# EAGLE design PIC Schematic (EAGLE 9.6.2)
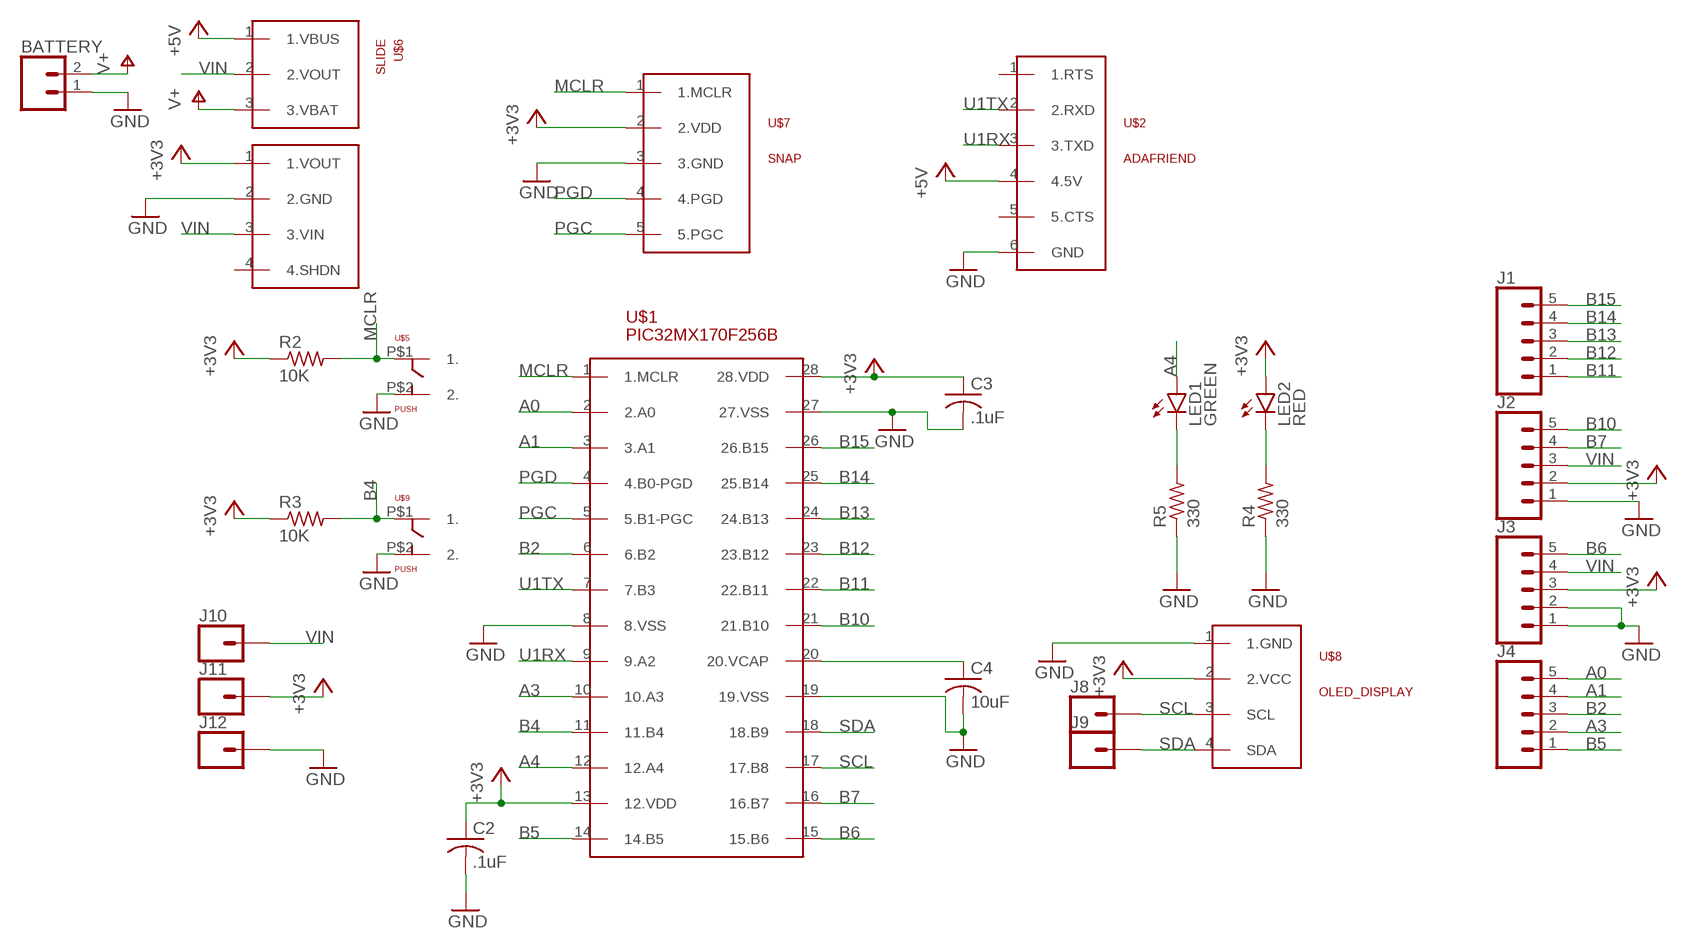
[diagram p0: schematic, sheet 1]

## Parts
BATTERY  CONN_02  [1X02]
C2  .1uF  C-US025-030X050  [C025-030X050]
C3  .1uF  C-US025-030X050  [C025-030X050]
C4  10uF  C-US025-030X050  [C025-030X050]
J1  CONN_05  [1X05]
J2  CONN_05  [1X05]
J3  CONN_05  [1X05]
J4  CONN_05  [1X05]
J8  CONN_01  [1X01]
J9  CONN_01  [1X01]
J10  CONN_01  [1X01]
J11  CONN_01  [1X01]
J12  CONN_01  [1X01]
LED1  GREEN  LED3MM  [LED3MM]
LED2  RED  LED3MM  [LED3MM]
R2  10K  R-US_0207/10  [0207/10]
R3  10K  R-US_0207/10  [0207/10]
R4  330  R-US_0207/10  [0207/10]
R5  330  R-US_0207/10  [0207/10]
U$1  PIC32MX170F256B  [DIL28-3]
U$2  ADAFRIEND  [ADAFRIEND]
U$3  POLOLU_3V3  [POLOLU_3V3]
U$5  PUSH  [PUSH]
U$6  SLIDE  [SLIDE]
U$7  SNAP  [SNAP]
U$8  OLED_DISPLAY  [OLED_DISPLAY]
U$9  PUSH  [PUSH]

## Nets
+3V3: C2.1 C3.1 J2.2 J3.3 J11.1 LED2.A R2.1 R3.1 U$1.13(12.VDD) U$1.28(28.VDD) U$3.1(1.VOUT) U$7.2(2.VDD) U$8.2(2.VCC)
+5V: U$2.4(4.5V) U$6.1(1.VBUS)
A0: J4.5 U$1.2(2.A0)
A1: J4.4 U$1.3(3.A1)
A3: J4.2 U$1.10(10.A3)
A4: LED1.A U$1.12(12.A4)
B2: J4.3 U$1.6(6.B2)
B4: R3.2 U$1.11(11.B4) U$9.P$1(1.)
B5: J4.1 U$1.14(14.B5)
B6: J3.5 U$1.15(15.B6)
B7: J2.4 U$1.16(16.B7)
B10: J2.5 U$1.21(21.B10)
B11: J1.1 U$1.22(22.B11)
B12: J1.2 U$1.23(23.B12)
B13: J1.3 U$1.24(24.B13)
B14: J1.4 U$1.25(25.B14)
B15: J1.5 U$1.26(26.B15)
GND: BATTERY.1 C2.2 C3.2 C4.2 J2.1 J3.1 J3.2 J12.1 R4.1 R5.1 U$1.8(8.VSS) U$1.19(19.VSS) U$1.27(27.VSS) U$2.6(GND) U$3.2(2.GND) U$5.P$2(2.) U$7.3(3.GND) U$8.1(1.GND) U$9.P$2(2.)
MCLR: R2.2 U$1.1(1.MCLR) U$5.P$1(1.) U$7.1(1.MCLR)
N$1: C4.1 U$1.20(20.VCAP)
N$2: LED1.K(C) R5.2
N$3: LED2.K(C) R4.2
PGC: U$1.5(5.B1-PGC) U$7.5(5.PGC)
PGD: U$1.4(4.B0-PGD) U$7.4(4.PGD)
SCL: J8.1 U$1.17(17.B8) U$8.3(SCL)
SDA: J9.1 U$1.18(18.B9) U$8.4(SDA)
U1RX: U$1.9(9.A2) U$2.3(3.TXD)
U1TX: U$1.7(7.B3) U$2.2(2.RXD)
V+: BATTERY.2 U$6.3(3.VBAT)
VIN: J2.3 J3.4 J10.1 U$3.3(3.VIN) U$6.2(2.VOUT)
Unconnected: U$2.1(1.RTS) U$2.5(5.CTS) U$3.4(4.SHDN)

## Library data of the parts
BATTERY = pic-library:CONN_02: Multi connection point. Often used as Generic Header-pin footprint for 0.1 inch spaced/style header connections On any of the 0.1 inch spaced packages, you can populate with these: Break Away Headers - Straight <https://www.sparkfun.com/products/116> (PRT-00116) Break Away Male Headers - Right Angle <https://www.sparkfun.com/products/553> (PRT-00553) Female Headers <https://www.sparkfun.com/products/115> (PRT-00115) Break Away Headers - Machine Pin <https://www.sparkfun.com/products/117> (PRT-00117) Break Away Female Headers - Swiss Machine Pin <https://www.sparkfun.com/products/743> (PRT-00743) For SCREWTERMINALS and SPRING TERMINALS visit here: Screw Terimnals on SparkFun.com <https://www.sparkfun.com/search/results?term=Screw+Terminals> (5mm/3.5mm/2.54mm spacing) This device is also useful as a general connection point to wire up your design to another part of your project. Our various solder wires solder well into these plated through hole pads. Hook-Up Wire - Assortment (Stranded, 22 AWG) <https://www.sparkfun.com/products/11375> (PRT-11375) Hook-Up Wire - Assortment (Solid Core, 22 AWG) <https://www.sparkfun.com/products/11367> (PRT-11367) View the entire wire category on our website here <https://www.sparkfun.com/categories/141> Special notes: Molex polarized connector foot print use with: PRT-08233 with associated crimp pins and housings. 2.54_SCREWTERM for use with PRT-10571. 3.5mm Screw Terminal footprints for PRT-08084 5mm Screw Terminal footprints for use with PRT-08432
C2-C4 = pic-library:C-US: CAPACITOR, American symbol; SPICEPREFIX: C
J1-J4 = pic-library:CONN_05: Multi connection point. Often used as Generic Header-pin footprint for 0.1 inch spaced/style header connections On any of the 0.1 inch spaced packages, you can populate with these: Break Away Headers - Straight <https://www.sparkfun.com/products/116> (PRT-00116) Break Away Male Headers - Right Angle <https://www.sparkfun.com/products/553> (PRT-00553) Female Headers <https://www.sparkfun.com/products/115> (PRT-00115) Break Away Headers - Machine Pin <https://www.sparkfun.com/products/117> (PRT-00117) Break Away Female Headers - Swiss Machine Pin <https://www.sparkfun.com/products/743> (PRT-00743) For SCREWTERMINALS and SPRING TERMINALS visit here: Screw Terimnals on SparkFun.com <https://www.sparkfun.com/search/results?term=Screw+Terminals> (5mm/3.5mm/2.54mm spacing) This device is also useful as a general connection point to wire up your design to another part of your project. Our various solder wires solder well into these plated through hole pads. Hook-Up Wire - Assortment (Stranded, 22 AWG) <https://www.sparkfun.com/products/11375> (PRT-11375) Hook-Up Wire - Assortment (Solid Core, 22 AWG) <https://www.sparkfun.com/products/11367> (PRT-11367) View the entire wire category on our website here <https://www.sparkfun.com/categories/141> Special notes: Molex polarized connector foot print use with SKU : PRT-08231 with associated crimp pins and housings. 1MM SMD Version SKU: PRT-10208
J8-J12 = pic-library:CONN_01: Single connection point. Often used as Generic Header-pin footprint for 0.1 inch spaced/style header connections On any of the 0.1 inch spaced packages, you can populate with these: Break Away Headers - Straight <https://www.sparkfun.com/products/116> (PRT-00116) Break Away Male Headers - Right Angle <https://www.sparkfun.com/products/553> (PRT-00553) Female Headers <https://www.sparkfun.com/products/115> (PRT-00115) Break Away Headers - Machine Pin <https://www.sparkfun.com/products/117> (PRT-00117) Break Away Female Headers - Swiss Machine Pin <https://www.sparkfun.com/products/743> (PRT-00743) This device is also useful as a general connection point to wire up your design to another part of your project. Our various solder wires solder well into these plated through hole pads. Hook-Up Wire - Assortment (Stranded, 22 AWG) <https://www.sparkfun.com/products/11375> (PRT-11375) Hook-Up Wire - Assortment (Solid Core, 22 AWG) <https://www.sparkfun.com/products/11367> (PRT-11367) View the entire wire category on our website here <https://www.sparkfun.com/categories/141> Special notes: SMTSO-256-ET is a "flush mount" nut for a 4-40 screw. We mostly use this on specialty testbeds; it is a nice way to connect hardware to your PCB at an adjustable hieght. Also note, the SNAP packages are for using a snappable style connector. We sell a baggie of snaps and they are also used on two LilyPad designs: Snap Assortment - 30 pack (male and female) <https://www.sparkfun.com/products/11347> (DEV-11347) LilyPad Arduino SimpleSnap <https://www.sparkfun.com/products/10941> (DEV-10941) LilyPad SimpleSnap Protoboard <https://www.sparkfun.com/products/10940> (DEV-10940)
LED1 LED2 = pic-library:LED: LED OSRAM: - CHIPLED LG R971, LG N971, LY N971, LG Q971, LY Q971, LO R971, LY R971 LH N974, LH R974 LS Q976, LO Q976, LY Q976 LO Q996 - Hyper CHIPLED LW Q18S LB Q993, LB Q99A, LB R99A - SideLED LS A670, LO A670, LY A670, LG A670, LP A670 LB A673, LV A673, LT A673, LW A673 LH A674 LY A675 LS A676, LA A676, LO A676, LY A676, LW A676 LS A679, LY A679, LG A679 - Hyper Micro SIDELED® LS Y876, LA Y876, LO Y876, LY Y876 LT Y87S - SmartLED LW L88C, LW L88S LB L89C, LB L89S, LG L890 LS L89K, LO L89K, LY L89K LS L896, LA L896, LO L896, LY L896 - TOPLED LS T670, LO T670, LY T670, LG T670, LP T670 LSG T670, LSP T670, LSY T670, LOP T670, LYG T670 LG T671, LOG T671, LSG T671 LB T673, LV T673, LT T673, LW T673 LH T674 LS T676, LA T676, LO T676, LY T676, LB T676, LH T676, LSB T676, LW T676 LB T67C, LV T67C, LT T67C, LS T67K, LO T67K, LY T67K, LW E67C LS E67B, LA E67B, LO E67B, LY E67B, LB E67C, LV E67C, LT E67C LW T67C LS T679, LY T679, LG T679 LS T770, LO T770, LY T770, LG T770, LP T770 LB T773, LV T773, LT T773, LW T773 LH T774 LS E675, LA E675, LY E675, LS T675 LS T776, LA T776, LO T776, LY T776, LB T776 LHGB T686 LT T68C, LB T68C - Hyper Mini TOPLED® LB M676 - Mini TOPLED Santana® LG M470 LS M47K, LO M47K, LY M47K Source: http://www.osram.convergy.de LUXEON: - LUMILED® LXK2-PW12-R00, LXK2-PW12-S00, LXK2-PW14-U00, LXK2-PW14-V00 LXK2-PM12-R00, LXK2-PM12-S00, LXK2-PM14-U00 LXK2-PE12-Q00, LXK2-PE12-R00, LXK2-PE12-S00, LXK2-PE14-T00, LXK2-PE14-U00 LXK2-PB12-K00, LXK2-PB12-L00, LXK2-PB12-M00, LXK2-PB14-N00, LXK2-PB14-P00, LXK2-PB14-Q00 LXK2-PR12-L00, LXK2-PR12-M00, LXK2-PR14-Q00, LXK2-PR14-R00 LXK2-PD12-Q00, LXK2-PD12-R00, LXK2-PD12-S00 LXK2-PH12-R00, LXK2-PH12-S00 LXK2-PL12-P00, LXK2-PL12-Q00, LXK2-PL12-R00 Source: www.luxeon.com KINGBRIGHT: KA-3528ASYC Source: www.kingbright.com
R2-R5 = pic-library:R-US_: RESISTOR, American symbol; SPICEPREFIX: R
U$1 = pic-library:PIC32MX170F256B
U$2 = pic-library:ADAFRIEND
U$3 = pic-library:POLOLU_3V3
U$5 U$9 = pic-library:PUSH
U$6 = pic-library:SLIDE
U$7 = pic-library:SNAP
U$8 = pic-library:OLED_DISPLAY

## Board
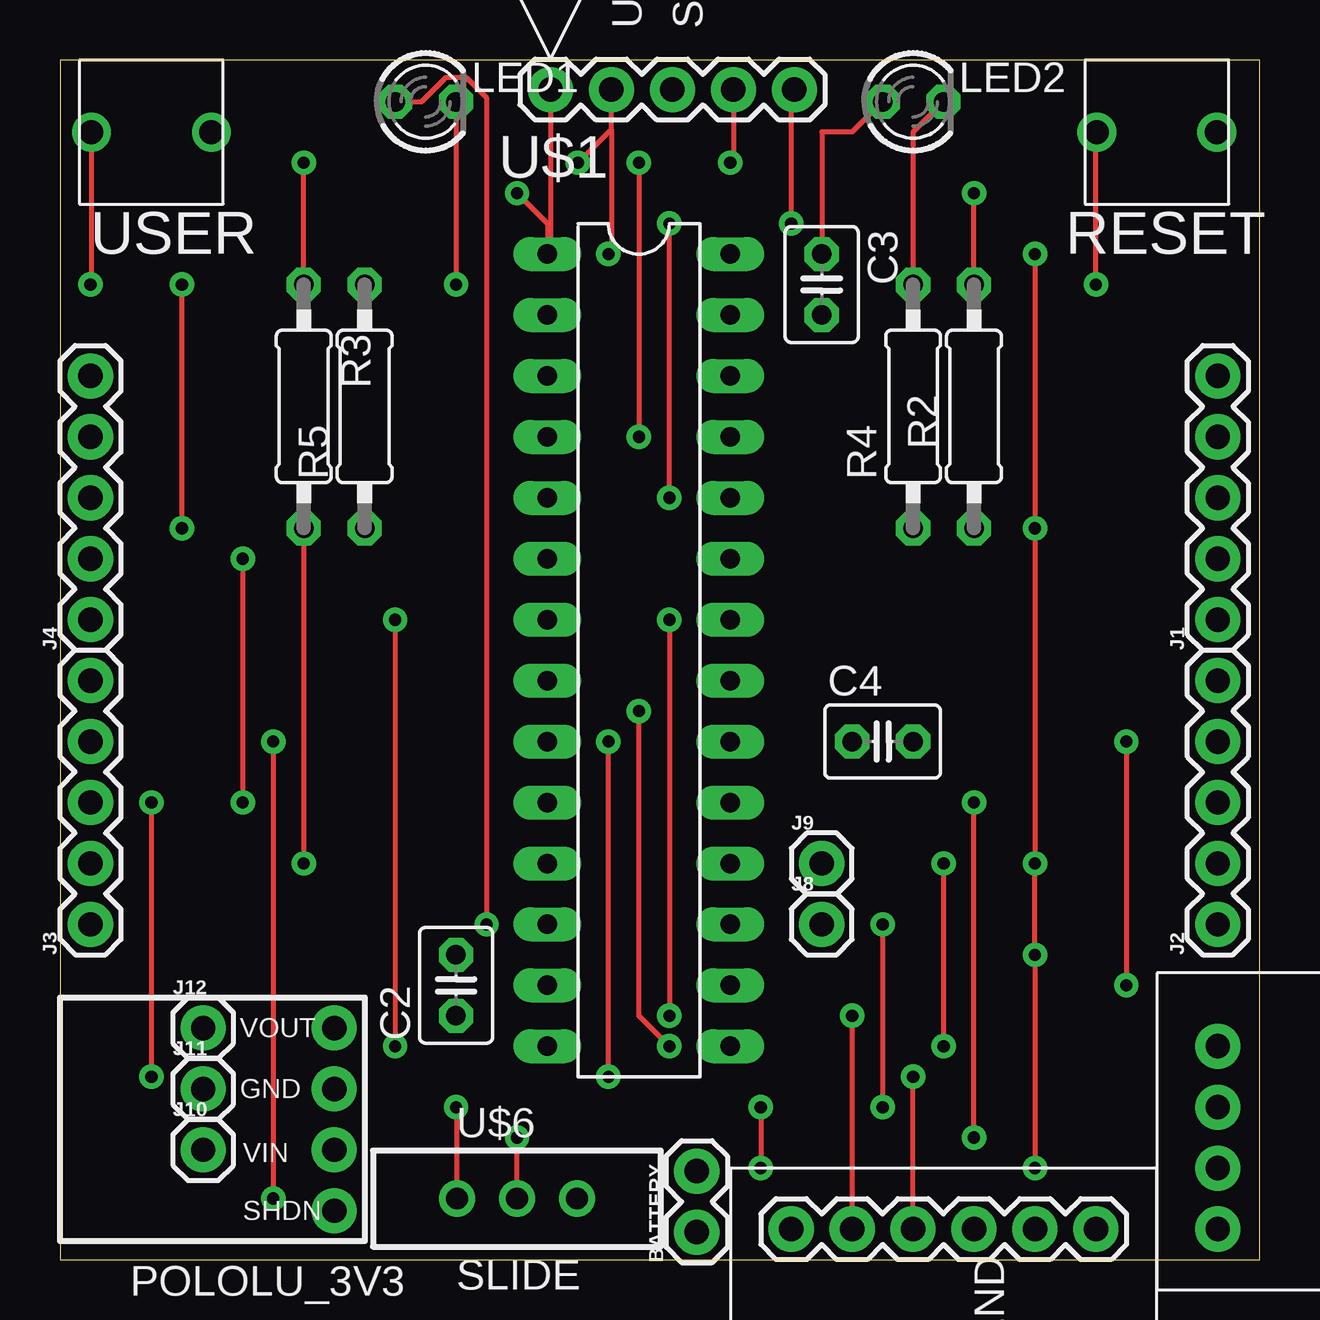
[diagram p1: board, top side]
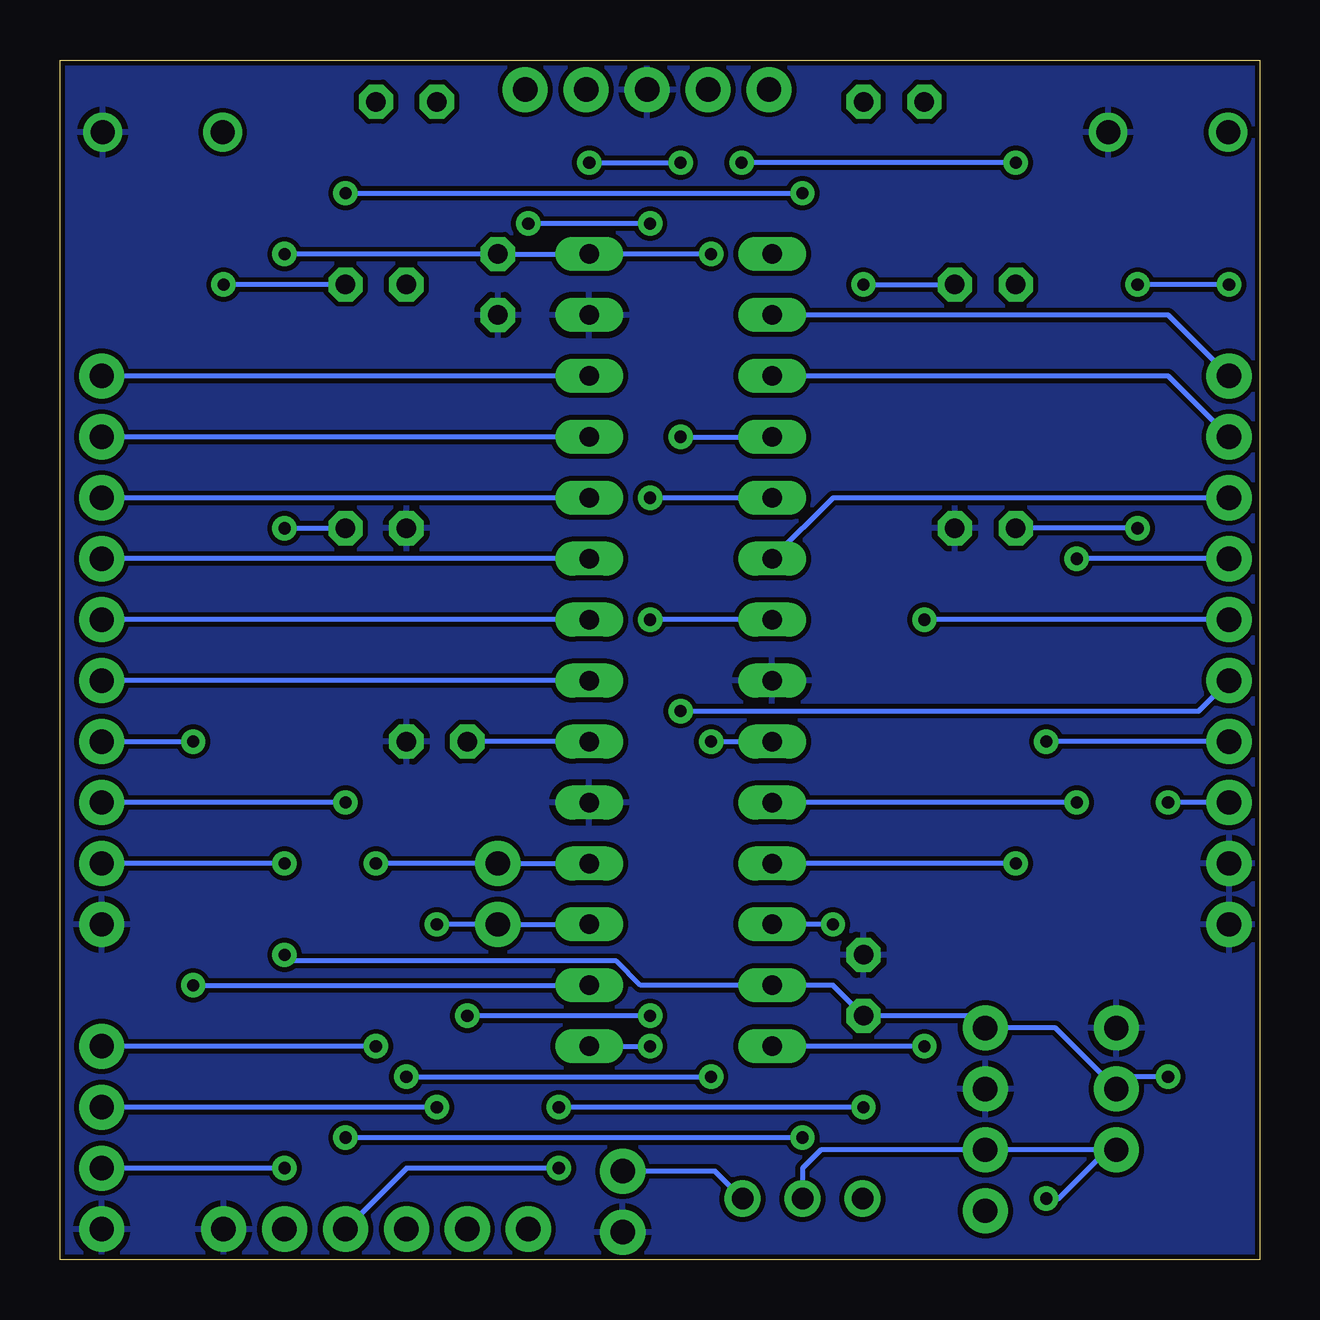
[diagram p2: board, bottom side, seen from below]

Size 50 x 50 mm. Coordinates in mm from the lower left corner, seen from the top.
Outline: 0,0 50,0 50,50 0,50 0,0
Copper layers (1*16): Top 0.035mm / dielectric 1.5mm / Bottom 0.035mm
Design rules "SparkFun": minimum track width 8mil, minimum drill 20mil, track to track 8mil, track to pad 8mil, pad to pad 8mil, via to via 8mil, smd to smd 8mil, copper to edge 8mil, drill to drill 8mil, minimum pad ring 12mil, minimum via ring 10mil, stop-mask expansion 4mil, vias tented up to drill 20mil, thermal gap 10mil

### Footprints (pad centres in the part's own frame; a part is rotated, then mirrored left to right if it is on the bottom)
1X02 = drill 1.016 pad 1.88: 1 0,0; 2 2.54,0
C025-030X050 = drill 0.813 octagon: 1 -1.27,0; 2 1.27,0
1X05 = drill 1.016 pad 1.88: 1 0,0; 2 2.54,0; 3 5.08,0; 4 7.62,0; 5 10.16,0
1X01 = drill 1.016 pad 1.88: 1 0,0
LED3MM = drill 0.813 octagon: A -1.27,0; K 1.27,0
0207/10 = drill 0.813 octagon: 1 -5.08,0; 2 5.08,0
DIL28-3 = drill 0.813 long: 1 -16.51,-3.81; 2 -13.97,-3.81; 3 -11.43,-3.81; 4 -8.89,-3.81; 5 -6.35,-3.81; 6 -3.81,-3.81; 7 -1.27,-3.81; 8 1.27,-3.81; 9 3.81,-3.81; 10 6.35,-3.81; 11 8.89,-3.81; 12 11.43,-3.81; 13 13.97,-3.81; 14 16.51,-3.81; 15 16.51,3.81; 16 13.97,3.81; 17 11.43,3.81; 18 8.89,3.81; 19 6.35,3.81; 20 3.81,3.81; 21 1.27,3.81; 22 -1.27,3.81; 23 -3.81,3.81; 24 -6.35,3.81; 25 -8.89,3.81; 26 -11.43,3.81; 27 -13.97,3.81; 28 -16.51,3.81
ADAFRIEND = drill 1.016 pad 1.88: 1 0,6.35; 2 0,3.81; 3 0,1.27; 4 0,-1.27; 5 0,-3.81; 6 0,-6.35
POLOLU_3V3 = drill 1.016 pad 1.88: 1 0,3.81; 2 0,1.27; 3 0,-1.27; 4 0,-3.81
PUSH = drill 1: P$1 -2.5,0; P$2 2.5,0
SLIDE = drill 0.9: 1 -2.5,0; 2 0,0; 3 2.5,0
SNAP = drill 1.016 pad 1.88: 1 0,5.08; 2 0,2.54; 3 0,0; 4 0,-2.54; 5 0,-5.08
OLED_DISPLAY = drill 1.016 pad 1.88: 1 16.51,3.81; 2 16.51,1.27; 3 16.51,-1.27; 4 16.51,-3.81

### Placement (x,y rotation side)
BATTERY  26.54,1.14 90 top
C2  16.51,11.43 90 top
C3  31.75,40.64 270 top
C4  34.29,21.59 0 top
J1  48.26,26.67 90 top
J2  48.26,13.97 90 top
J3  1.27,13.97 90 top
J4  1.27,26.67 90 top
J8  31.75,13.97 0 top
J9  31.75,16.51 0 top
J10  5.97,4.57 0 top
J11  5.97,7.11 0 top
J12  5.97,9.65 0 top
LED1  15.24,48.26 0 top
LED2  35.56,48.26 0 top
R2  38.1,35.56 90 top
R3  10.16,35.56 270 top
R4  35.56,35.56 90 top
R5  12.7,35.56 90 top
U$1  24.13,25.4 270 top
U$2  36.83,1.27 90 top
U$3  11.43,5.84 0 top
U$5  45.72,46.99 0 top
U$6  19.05,2.54 0 top
U$7  25.53,48.77 90 top
U$8  64.77,5.08 180 top
U$9  3.81,46.99 0 top

### Tracks (layer width: path | path; a pad name or v marks a point on that pad's centre or on a via)
+3V3  (via drill 0.51)
  Top 0.203: LED2.A 33.02,46.99 31.75,46.99 C3.1 | 22.99,47.12 22.99,42.04 v22.86,41.91 | v40.64,41.91 v40.64,30.48 v40.64,16.51 v40.64,12.7 v40.64,3.81 | R3.1 v10.16,45.72 | v21.59,45.72 22.99,47.12 | 22.99,47.12 U$7.2 | v3.81,19.05 v3.81,7.62
  Bottom 0.203: v22.86,41.91 U$1.28 C3.1 v40.64,41.91 | v40.64,30.48 R2.1 | v40.64,16.51 J2.2 | v10.16,45.72 v21.59,45.72 | v40.64,12.7 40.39,12.45 26.81,12.45 25.79,11.43 U$1.13 17.78,11.43 C2.1 11.94,10.16 U$3.1 8.51,9.65 J11.1 5.46,7.62 v3.81,7.62 | v40.64,3.81 U$8.2 | J3.3 v3.81,19.05
+5V  (via drill 0.51)
  Top 0.203: U$6.1 16.55,6.31 v16.51,6.35 | v29.21,6.35 v29.21,3.81
  Bottom 0.203: v16.51,6.35 v29.21,6.35 | v29.21,3.81 35.56,3.81 U$2.4
A0
  Bottom 0.203: J4.5 3.81,39.37 U$1.2
A1
  Bottom 0.203: J4.4 3.81,36.83 U$1.3
A3  (via drill 0.51)
  Top 0.203: v7.62,29.21 v7.62,19.05
  Bottom 0.203: J4.2 v7.62,29.21 | v7.62,19.05 U$1.10
A4  (via drill 0.51)
  Top 0.203: v17.78,13.97 17.78,48.43 16.93,49.28 16.09,49.28 15.07,48.26 LED1.A
  Bottom 0.203: v17.78,13.97 U$1.12
B2
  Bottom 0.203: J4.3 17.78,31.75 U$1.6
B4  (via drill 0.51)
  Top 0.203: U$9.P$1 1.31,40.68 v1.27,40.64 | v5.08,40.64 v5.08,30.48 | R3.2 v10.16,16.51
  Bottom 0.203: v1.27,40.64 v5.08,40.64 | v5.08,30.48 R3.2 | v10.16,16.51 U$1.11
B5  (via drill 0.51)
  Top 0.203: v13.97,26.67 v13.97,8.89
  Bottom 0.203: J4.1 v13.97,26.67 | v13.97,8.89 U$1.14
B6  (via drill 0.51)
  Top 0.203: v25.4,8.89 24.13,10.16 v24.13,22.86
  Bottom 0.203: U$1.15 v25.4,8.89 | v24.13,22.86 2.54,22.86 J3.5
B7  (via drill 0.51)
  Top 0.203: v44.45,21.59 v44.45,11.43
  Bottom 0.203: J2.4 v44.45,21.59 | v44.45,11.43 U$1.16
B10
  Bottom 0.203: U$1.21 J2.5
B11
  Bottom 0.203: U$1.22 J1.1
B12
  Bottom 0.203: U$1.23 J1.2
B13
  Bottom 0.203: U$1.24 J1.3
B14
  Bottom 0.203: U$1.25 J1.4
B15
  Bottom 0.203: U$1.26 J1.5
GND
  pour Bottom: 0,50.8 0,0 50.8,0 50.8,50.8
MCLR  (via drill 0.51)
  Top 0.203: U$7.1 20.45,42.04 U$1.1 20.32,43.18 v19.05,44.45 | v43.18,40.64 43.18,46.95 U$5.P$1 | R2.2 v38.1,44.45
  Bottom 0.203: R2.2 v43.18,40.64 | v38.1,44.45 v19.05,44.45
N$1
  Bottom 0.203: U$1.20 C4.1
N$2  (via drill 0.51)
  Top 0.203: LED1.K v16.51,40.64
  Bottom 0.203: v16.51,40.64 R5.2
N$3
  Top 0.203: LED2.K 35.56,46.99 R4.2
PGC  (via drill 0.51)
  Top 0.203: v25.4,31.75 v25.4,43.18 | v30.48,43.18 30.48,48.64 U$7.5
  Bottom 0.203: U$1.5 v25.4,31.75 | v25.4,43.18 v30.48,43.18
PGD  (via drill 0.51)
  Top 0.203: U$7.4 28.07,45.85 v27.94,45.72 | v24.13,45.72 v24.13,34.29
  Bottom 0.203: v27.94,45.72 v24.13,45.72 | v24.13,34.29 U$1.4
SCL  (via drill 0.51)
  Top 0.203: v34.29,13.97 v34.29,6.35
  Bottom 0.203: U$1.17 J8.1 v34.29,13.97 | v34.29,6.35 U$8.3
SDA  (via drill 0.51)
  Top 0.203: v36.83,16.51 v36.83,8.89
  Bottom 0.203: U$1.18 J9.1 v36.83,16.51 | v36.83,8.89 U$8.4
U1RX  (via drill 0.51)
  Top 0.203: U$2.3 v35.56,7.62 | v22.86,7.62 v22.86,21.59
  Bottom 0.203: v35.56,7.62 v22.86,7.62 | v22.86,21.59 U$1.9
U1TX  (via drill 0.51)
  Top 0.203: v25.4,26.67 v25.4,10.16 | v33.02,10.16 U$2.2
  Bottom 0.203: U$1.7 v25.4,26.67 | v25.4,10.16 v33.02,10.16
V+
  Bottom 0.203: U$6.3 22.69,3.68 BATTERY.2
VIN  (via drill 0.51)
  Top 0.203: v8.89,21.59 v8.89,2.54 | U$6.2 v19.05,5.08 | v38.1,5.08 v38.1,19.05
  Bottom 0.203: J10.1 6.35,4.57 | 6.35,4.57 U$3.3 18.29,4.57 19.05,3.81 U$6.2 | J3.4 v8.89,21.59 | v8.89,2.54 8.38,2.54 6.35,4.57 | v19.05,5.08 v38.1,5.08 | v38.1,19.05 J2.3

### Text on the board
tPlace: USER | RESET